# Altium schematic sheet LOOM - HV BOX.SchDoc
size 297 x 209 mm
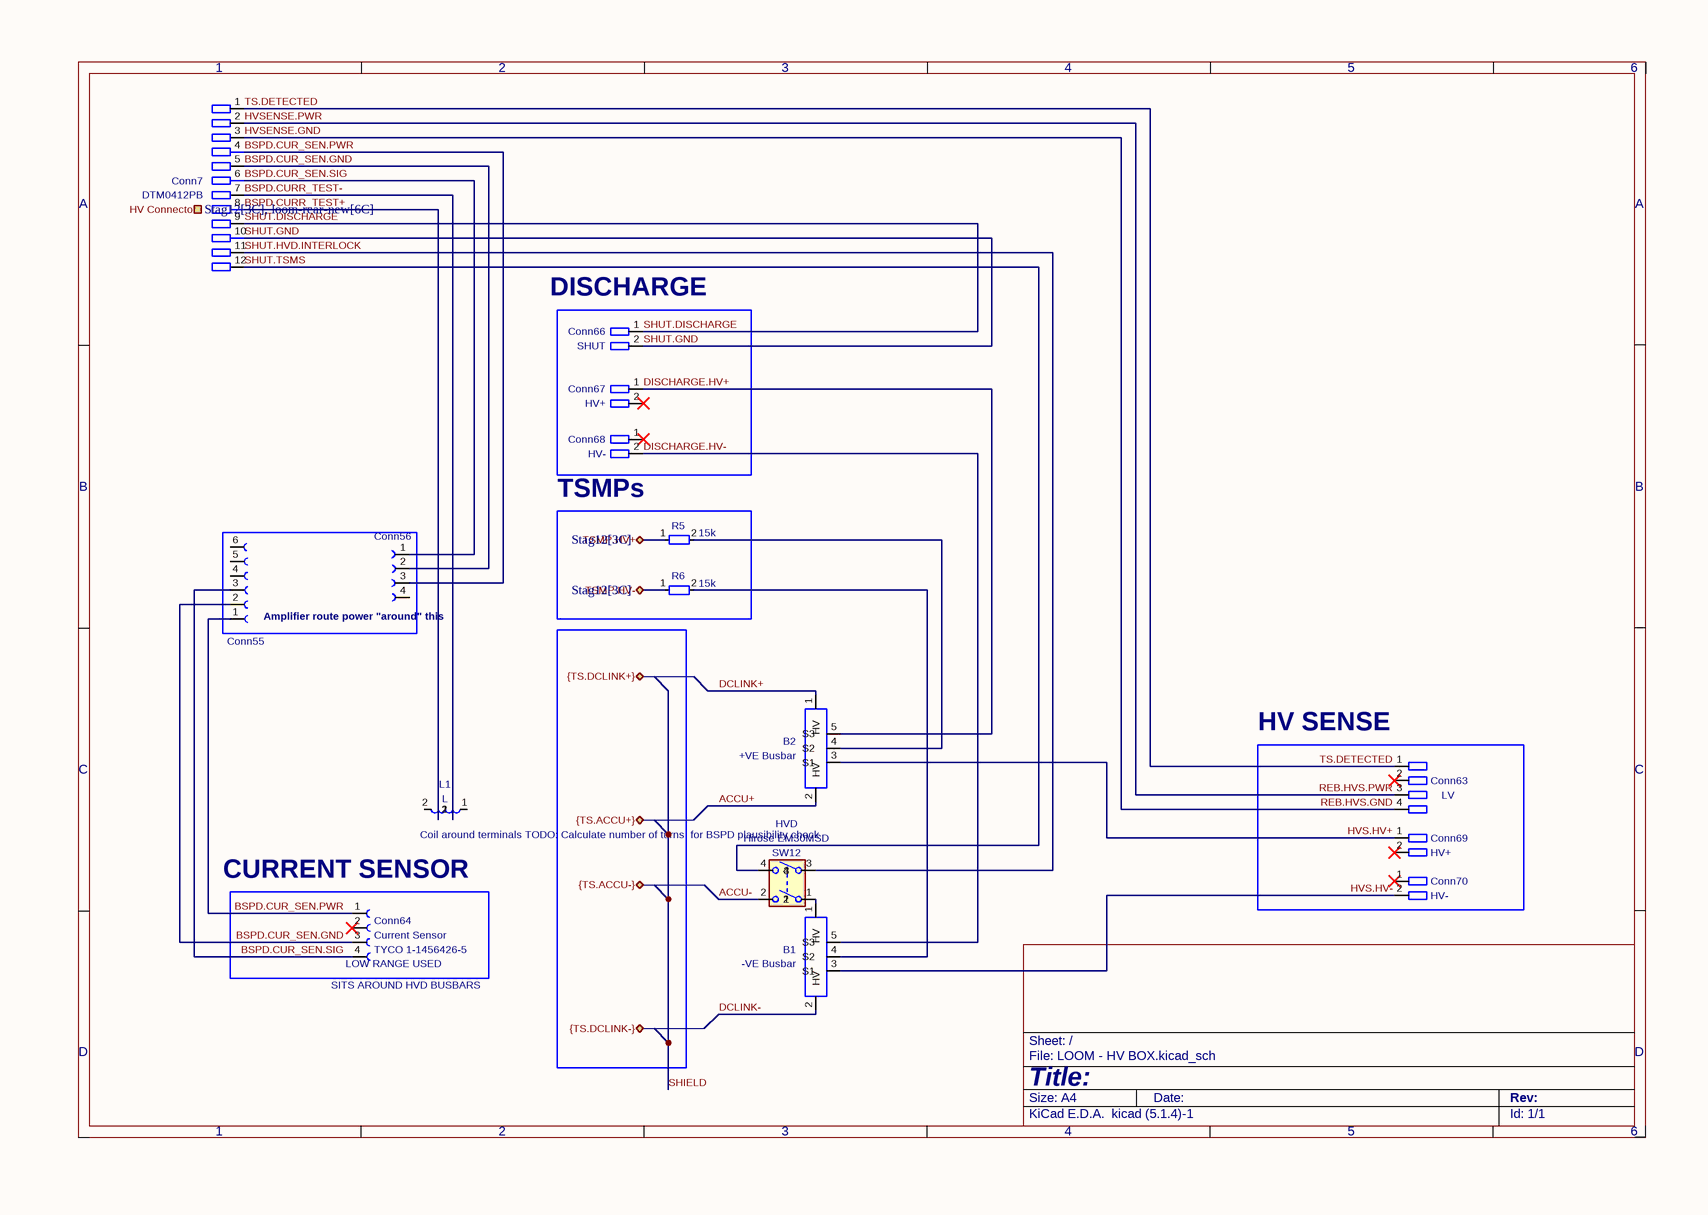
[diagram p0: LOOM - HV BOX.SchDoc]

## Parts
B1  -VE Busbar
B2  +VE Busbar
Conn7  P/N: DTM0412PB  (hidden comment: Deutsch_DTM_12P_Pin)
Conn55  Molex_3x2S_Recepticle  (value not drawn)
Conn56  Molex_2x2S_Recepticle  (value not drawn)
Conn63  Name: LV  (hidden comment: ~)
Conn64  P/N: TYCO 1-1456426-5  (hidden comment: Current Sensor)
Conn66  Name: SHUT  (hidden comment: Molex_2x1P_Horizontal_THT)
Conn67  Name: HV+  (hidden comment: Molex_2x1P_Horizontal_THT)
Conn68  Name: HV-  (hidden comment: Molex_2x1P_Horizontal_THT)
Conn69  Name: HV+  (hidden comment: Molex_2x1P_Horizontal_THT)
Conn70  Name: HV-  (hidden comment: Molex_2x1P_Horizontal_THT)
L1  L
R5  15k
R6  15k
SW12  Conn Name: HVD  (hidden comment: Hirose EM30MSD)

## Blocks framed on the sheet
Amplifier / route power "around" this: Conn55 Conn56
TSMPs: R5 R6
HV SENSE: Conn63 Conn69 Conn70
LOW RANGE USED: Conn64

## Ports
HV Connector (in, see Stag12[3C], loom-rear-new[6C]), TSMP.HV+ (bidir, see Stag12[3C]), TSMP.HV- (bidir, see Stag12[3C]), {TS.ACCU+} (bidir), {TS.ACCU-} (bidir), {TS.DCLINK+} (bidir), {TS.DCLINK-} (bidir)

## Nets
ACCU+: B2.2(HV)
ACCU-: SW12.2
BSPD.CUR_SEN.GND: Conn7.5 Conn55.2 Conn56.2 Conn64.3
BSPD.CUR_SEN.PWR: Conn7.4 Conn55.1 Conn56.3 Conn64.1
BSPD.CUR_SEN.SIG: Conn7.6 Conn55.3 Conn56.1 Conn64.4
BSPD.CURR_TEST+: Conn7.8
BSPD.CURR_TEST-: Conn7.7
DCLINK+: B2.1(HV)
DCLINK-: B1.2(HV)
DISCHARGE.HV+: B2.5(S3) Conn67.1
DISCHARGE.HV-: B1.5(S3) Conn68.2
HVS.HV+: B2.3(S1) Conn69.1
HVS.HV-: B1.3(S1) Conn70.2
HVSENSE.GND: Conn7.3 Conn63.4  [also labelled REB.HVS.GND]
HVSENSE.PWR: Conn7.2 Conn63.3  [also labelled REB.HVS.PWR]
SHUT.DISCHARGE: Conn7.9 Conn66.1
SHUT.GND: Conn7.10 Conn66.2
SHUT.HVD.INTERLOCK: Conn7.11 SW12.3
SHUT.TSMS: Conn7.12 SW12.4
TS.DETECTED: Conn7.1 Conn63.1
TSMP.HV+: R5.1 ; port TSMP.HV+
TSMP.HV-: R6.1 ; port TSMP.HV-
NetB1_1: B1.1(HV) SW12.1
NetB1_4: B1.4(S2) R6.2
NetB2_4: B2.4(S2) R5.2

Not connected (* = marked no-connect by the designer): Conn55 4 5 6; Conn56 4; Conn63 2*; Conn64 2*; Conn67 2*; Conn68 1*; Conn69 2*; Conn70 1*; L1 1 2

## Notes on the sheet
- (near Conn66) DISCHARGE
- Coil around terminals
  TODO: Calculate number of turns
  for BSPD plausibility check
- (near Conn64) CURRENT SENSOR
- (near Conn64) SITS AROUND HVD BUSBARS
- 1
- 2
- 3
- 4
- 5
- 6
- A
- B
- C
- D
- Title:
- File: LOOM - HV BOX.kicad_sch
- Sheet: /
- KiCad E.D.A.  kicad (5.1.4)-1
- Size: A4
- Date:
- Rev:
- Id: 1/1

## Library data of the parts
B1 B2 = Bus_Bar
  B1: Value: -VE Busbar
  B2: Value: +VE Busbar
Conn55 = Molex_3x2S_Recepticle: P/N: 43025-0600; Value: Molex_3x2S_Recepticle
Conn56 = Molex_2x2S_Recepticle: P/N: 43025-0400; Value: Molex_2x2S_Recepticle
Conn63 = Molex_2x2P_Horizontal_1: P/N: 43045-0400; Value: ~
Conn64 = Current Sensor Connector: Value: Current Sensor
Conn66-Conn70 = Molex_2x1P_Horizontal_THT: P/N: 43650-0200; Value: Molex_2x1P_Horizontal_THT
R5 R6 = R_Small: Value: 15k
SW12 = SW_DPST: Value: Hirose EM30MSD
Conn7 = Deutsch_DTM_12P_Pin: Value: Deutsch_DTM_12P_Pin
L1 = L: Value: L